# EAGLE design Ebot8_v_2 (EAGLE 7.7.0)
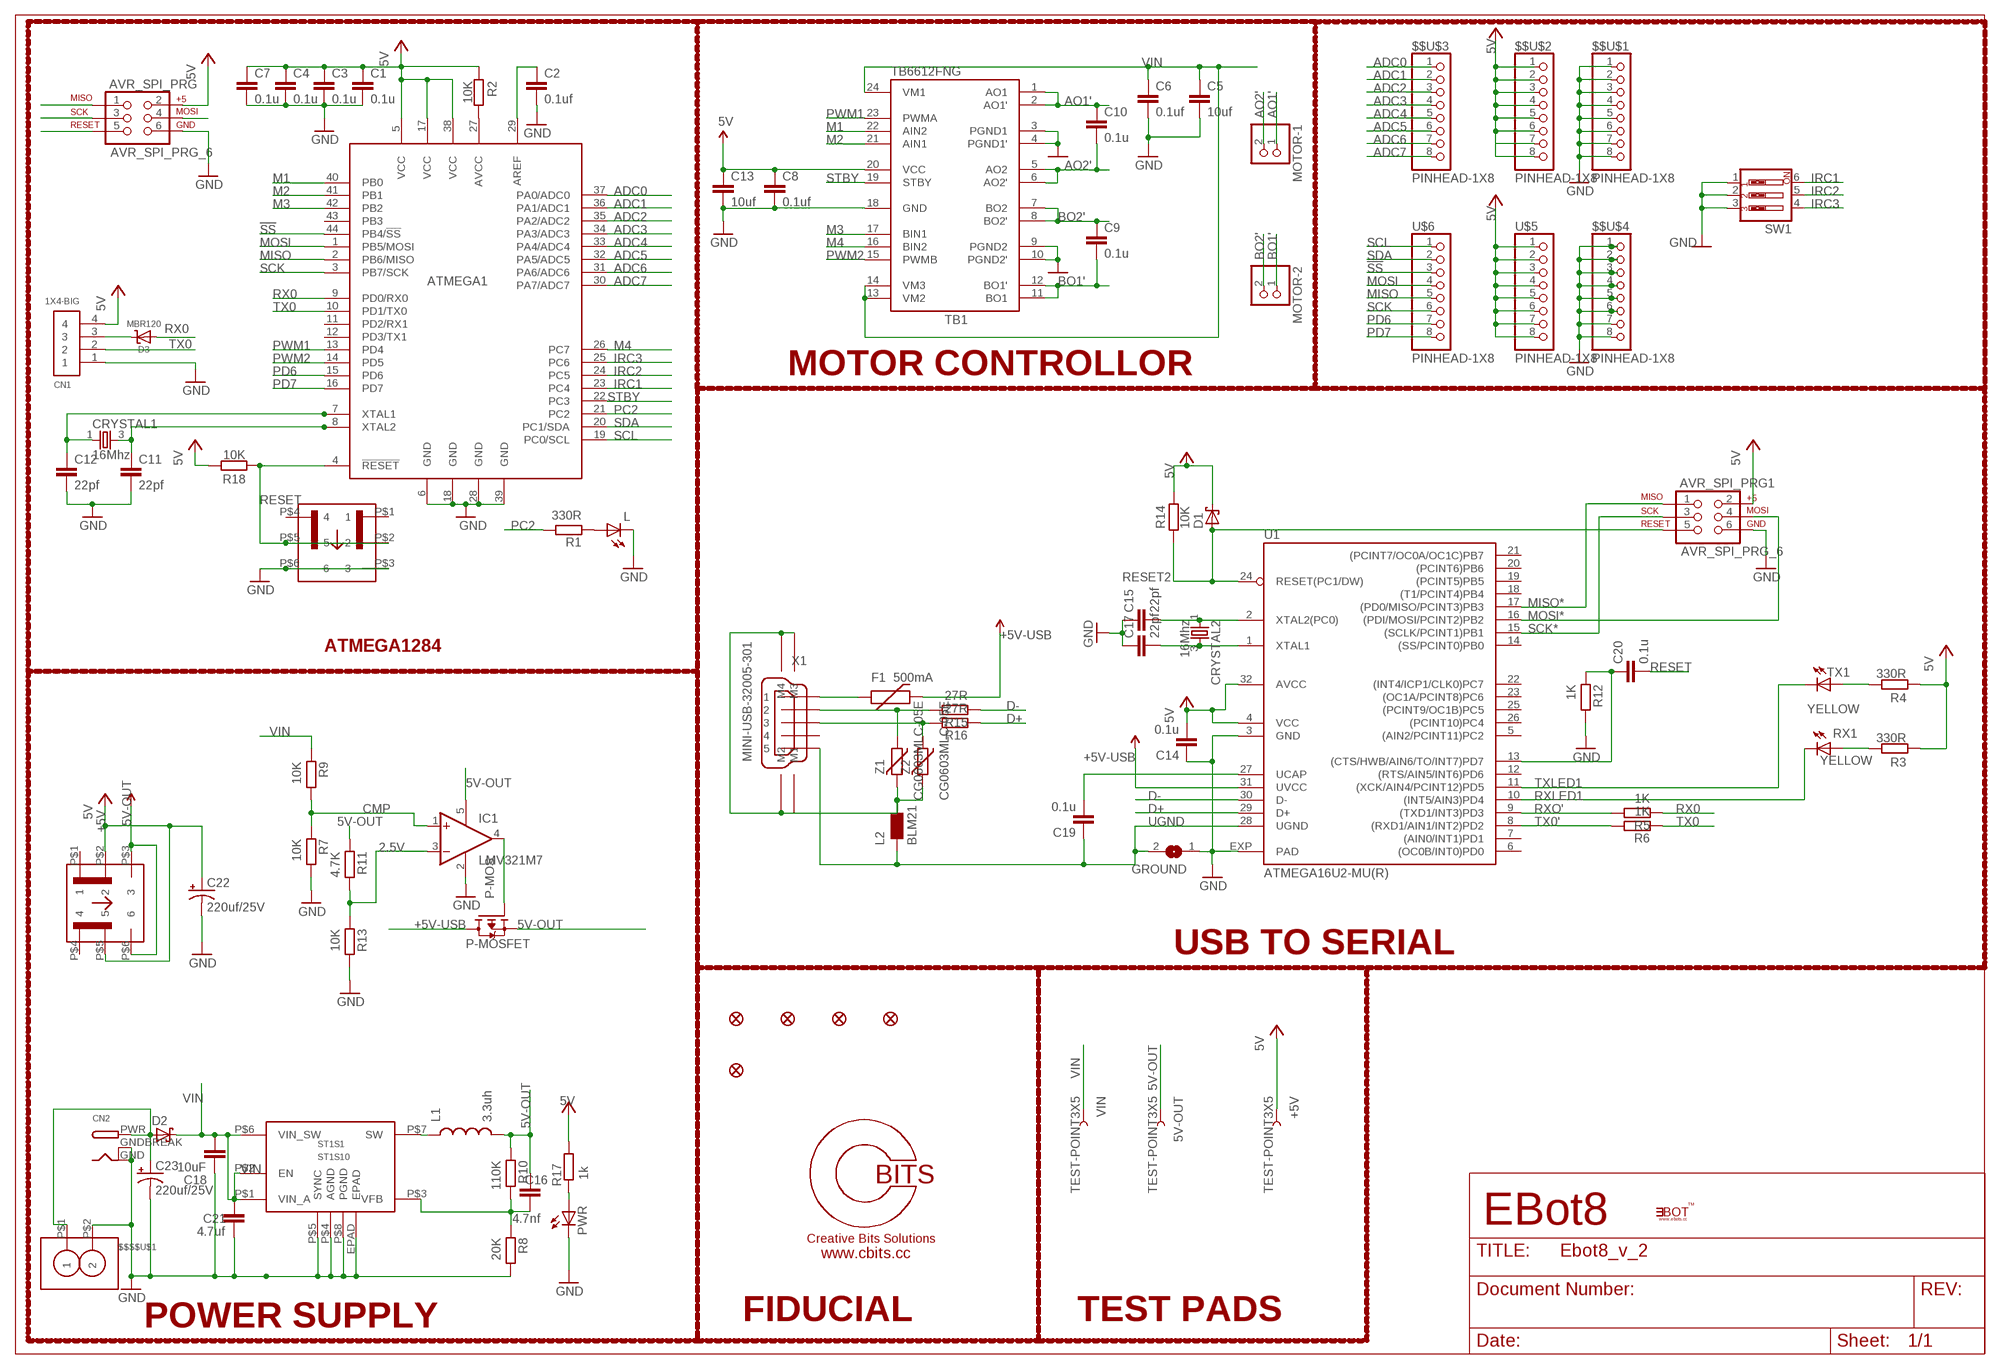
[diagram p0: schematic, sheet 1]

## Parts
5V-OUT  TEST-POINT3X5  [PAD.03X.05]
$$$$U$1  SCREW_CONNECTOR-2PIN-  [SCREW_CONNECTOR-2PIN-5.08MM]
$$U$1  PINHEAD-1X8  [PINHEAD-1X8]
$$U$2  PINHEAD-1X8  [PINHEAD-1X8]
$$U$3  PINHEAD-1X8  [PINHEAD-1X8]
$$U$4  PINHEAD-1X8  [PINHEAD-1X8]
+5V  TEST-POINT3X5  [PAD.03X.05]
ATMEGA1  ATMEGA164A/PA/324A/PA/644A/PA/1284/P  [44TQFP]
AVR_SPI_PRG  AVR_SPI_PRG_6  [2X3]
AVR_SPI_PRG1  AVR_SPI_PRG_6  [2X3]
C1  0.1u  CAPACITOR  [C0603]
C2  0.1uf  CAPACITOR  [C0603]
C3  0.1u  CAPACITOR  [C0603]
C4  0.1u  CAPACITOR  [C0603]
C5  10uf  CAPACITOR  [C0603]
C6  0.1uf  CAPACITOR  [C0603]
C7  0.1u  CAPACITOR  [C0603]
C8  0.1uf  CAPACITOR  [C0603]
C9  0.1u  CAPACITOR  [C0603]
C10  0.1u  CAPACITOR  [C0603]
C11  22pf  CAPACITOR  [C0603]
C12  22pf  CAPACITOR  [C0603]
C13  10uf  CAPACITOR  [C0603]
C14  0.1u  CAPACITOR  [C0603]
C15  22pf  CAPACITOR  [C0603]
C16  4.7nf  CAPACITOR  [C0603]
C17  22pf  CAPACITOR  [C0603]
C18  10uF  CAPACITOR  [C0603]
C19  0.1u  CAPACITOR  [C0603]
C20  0.1u  CAPACITOR  [C0603]
C21  4.7uf  CAPACITOR  [C0603]
C22  220uf/25V  CPOL-USE2.5-6  [E2,5-6]
C23  220uf/25V  CPOL-USE2.5-6  [E2,5-6]
CN1  1X4-BIG  [1X04-BIG]
CN2  DCBARRELPTH  [DCJACK_2MM_PTH]
CRYSTAL1  16Mhz  CRYSTAL4PIN  [CRYSTAL-4PIN]
CRYSTAL2  16Mhz  CRYSTAL4PIN  [CRYSTAL-4PIN]
D1  SCHOTTKY-DIODESMA2  [SCHOTTKY_SMA]
D2  SCHOTTKY-DIODESMA2  [SCHOTTKY_SMA]
D3  MBR120  DIODE-SCHOTTKYSOD-123  [SOD-123]
F1  500mA  PTCSMD  [PTC-1206]
FID1  FIDUCIAL1.5X3  [FIDUCIAL-1.5X3]
FID2  FIDUCIAL1.5X3  [FIDUCIAL-1.5X3]
FID3  FIDUCIAL1.5X3  [FIDUCIAL-1.5X3]
FID4  FIDUCIAL1.5X3  [FIDUCIAL-1.5X3]
FID100  FIDUCIAL1.5X3  [FIDUCIAL-1.5X3]
GROUND  SJ  [SJ]
IC1  LMV321M7  [SC70-5L]
L  LEDCHIP-LED0603  [CHIP-LED0603]
L1  3.3uh  INDUCTORCR54  [CR54]
L2  BLM21  WE-CBF_0805  [0805]
LOGO1  CBITS_LOGO  [CBITS_LOGO]
MOTOR-1  PINHD-1X2  [1X02]
MOTOR-2  PINHD-1X2  [1X02]
P-MOS  P-MOSFET  [SOT23-R]
POWER  PUSHBUTTON_SWITCH-CW179-ND  PUSHBUTTON_SWITCH-ON-OFF  [PUSHBUTTON_SWITCH]
PWR  LEDCHIP-LED0603  [CHIP-LED0603]
R1  330R  RESISTOR  [R0603]
R2  10K  RESISTOR  [R0603]
R3  330R  RESISTOR  [R0603]
R4  330R  RESISTOR  [R0603]
R5  1K  RESISTOR  [R0603]
R6  1K  RESISTOR  [R0603]
R7  10K  RESISTOR  [R0603]
R8  20K  RESISTOR  [R0603]
R9  10K  RESISTOR  [R0603]
R10  110K  RESISTOR  [R0603]
R11  4.7K  RESISTOR  [R0603]
R12  1K  RESISTOR  [R0603]
R13  10K  RESISTOR  [R0603]
R14  10K  RESISTOR  [R0603]
R15  27R  RESISTOR  [R0603]
R16  27R  RESISTOR  [R0603]
R17  1k  RESISTOR  [R0603]
R18  10K  RESISTOR  [R0603]
RESET  PUSHBUTTON_SWITCH-ON-MOM  [PUSHBUTTON_SWITCH]
RX1  YELLOW  LEDCHIP-LED0603  [CHIP-LED0603]
ST1S1  ST1S10  [ST1S10]
SW1  SW_DIP-3  [EDG-03]
TB1  TB6612FNG  [SSOP24]
TX1  YELLOW  LEDCHIP-LED0603  [CHIP-LED0603]
U1  ATMEGA16U2-MU(R)  SMARTPRJ_ATMEGA16U2-  [SMARTPRJ_ATMEL_QFN32]
U$5  PINHEAD-1X8  [PINHEAD-1X8]
U$6  PINHEAD-1X8  [PINHEAD-1X8]
U$14  EBOT_LOGO  [EBOT_LOGO]
VIN  TEST-POINT3X5  [PAD.03X.05]
X1  MINI-USB-32005-301  [32005-301]
Z1  CG0603MLC-05E  VARISTORCN0603  [CT/CN0603]
Z2  CG0603MLC-05E  VARISTORCN0603  [CT/CN0603]

## Nets
2.5V: IC1.3(-IN) R11.2 R13.1
5V-OUT: 5V-OUT.P$1 C16.1 IC1.5(V+) L1.P$2 P-MOS.2(S) POWER.P$3 POWER.P$6 R10.1 R11.1 ; supply symbol labelled 5V
!SS: ATMEGA1.44(PB4/!SS) U$6.3
+5V: $$U$2.1 $$U$2.2 $$U$2.3 $$U$2.4 $$U$2.5 $$U$2.6 $$U$2.7 $$U$2.8 +5V.P$1 ATMEGA1.5(VCC) ATMEGA1.17(VCC) ATMEGA1.38(VCC) AVR_SPI_PRG1.2 AVR_SPI_PRG.2 C1.1 C3.1 C4.1 C7.1 C8.1 C13.1 C14.2 C22.+ CN1.4 D1.C POWER.P$2 POWER.P$5 R2.1 R3.1 R4.1 R14.2 R17.2 R18.2 TB1.20(VCC) U1.4(VCC) U1.32(AVCC) U$5.1 U$5.2 U$5.3 U$5.4 U$5.5 U$5.6 U$5.7 U$5.8 ; supply symbol labelled 5V
+5V-USB: F1.2 P-MOS.3(D) U1.31(UVCC) ; supply symbol labelled 5V
ADC0: $$U$3.1 ATMEGA1.37(PA0/ADC0)
ADC1: $$U$3.2 ATMEGA1.36(PA1/ADC1)
ADC2: $$U$3.3 ATMEGA1.35(PA2/ADC2)
ADC3: $$U$3.4 ATMEGA1.34(PA3/ADC3)
ADC4: $$U$3.5 ATMEGA1.33(PA4/ADC4)
ADC5: $$U$3.6 ATMEGA1.32(PA5/ADC5)
ADC6: $$U$3.7 ATMEGA1.31(PA6/ADC6)
ADC7: $$U$3.8 ATMEGA1.30(PA7/ADC7)
AO1': C10.1 MOTOR-1.1 TB1.1(AO1) TB1.2(AO1')
AO2': C10.2 MOTOR-1.2 TB1.5(AO2) TB1.6(AO2')
AREF: ATMEGA1.29(AREF) C2.1
BO1': C9.2 MOTOR-2.1 TB1.11(BO1) TB1.12(BO1')
BO2': C9.1 MOTOR-2.2 TB1.7(BO2) TB1.8(BO2')
CMP: IC1.1(+IN) R7.1 R9.2
D+: R16.1 U1.29(D+)
D-: R15.1 U1.30(D-)
GATE_CMD: IC1.4(OUT) P-MOS.1(G)
GND: $$$$U$1.P$2 $$U$1.1 $$U$1.2 $$U$1.3 $$U$1.4 $$U$1.5 $$U$1.6 $$U$1.7 $$U$1.8 $$U$4.1 $$U$4.2 $$U$4.3 $$U$4.4 $$U$4.5 $$U$4.6 $$U$4.7 $$U$4.8 ATMEGA1.6(GND) ATMEGA1.18(GND) ATMEGA1.28(GND) ATMEGA1.39(GND) AVR_SPI_PRG1.6 AVR_SPI_PRG.6 C1.2 C2.2 C3.2 C4.2 C5.2 C6.2 C7.2 C8.2 C11.2 C12.2 C13.2 C14.1 C15.1 C17.1 C18.2 C21.2 C22.- C23.- CN1.1 CN2.GND CN2.GNDBREAK GROUND.1 IC1.2(V-) L.C PWR.C R7.2 R8.2 R12.2 R13.2 RESET.P$3 RESET.P$6 ST1S1.EPAD ST1S1.P$4(AGND) ST1S1.P$5(SYNC) ST1S1.P$8(PGND) SW1.1 SW1.2 SW1.3 TB1.3(PGND1) TB1.4(PGND1') TB1.9(PGND2) TB1.10(PGND2') TB1.18(GND) U1.3(GND) U1.EXP(PAD)
IRC1: ATMEGA1.23(PC4) SW1.6
IRC2: ATMEGA1.24(PC5) SW1.5
IRC3: ATMEGA1.25(PC6) SW1.4
M1: ATMEGA1.40(PB0) TB1.22(AIN2)
M2: ATMEGA1.41(PB1) TB1.21(AIN1)
M3: ATMEGA1.42(PB2) TB1.17(BIN1)
M4: ATMEGA1.26(PC7) TB1.16(BIN2)
MISO: ATMEGA1.2(PB6/MISO) AVR_SPI_PRG.1 U$6.5
MISO*: AVR_SPI_PRG1.1 U1.17((PD0/MISO/PCINT3)PB3)
MOSI: ATMEGA1.1(PB5/MOSI) AVR_SPI_PRG.4 U$6.4
MOSI*: AVR_SPI_PRG1.4 U1.16((PDI/MOSI/PCINT2)PB2)
N$1: PWR.A R17.1
N$2: $$$$U$1.P$1 C23.+ CN2.PWR D2.A
N$3: R3.2 RX1.A
N$4: R4.2 TX1.A
N$5: C15.2 CRYSTAL2.1 U1.2(XTAL2(PC0))
N$6: ATMEGA1.27(AVCC) R2.2
N$7: C17.2 CRYSTAL2.3 U1.1(XTAL1)
N$8: C19.2 U1.27(UCAP)
N$9: C20.1 R12.1 U1.13((CTS/HWB/AIN6/TO/INT7)PD7)
N$10: L2.2 X1.M1 X1.M2 X1.M3 X1.M4 Z1.2 Z2.2
N$11: CN1.3 D3.C
N$17: L.A R1.1
N$20: F1.1 X1.1
N$21: R15.2 X1.2 Z1.1
N$23: R16.2 X1.3 Z2.1
N$37: L1.P$1 ST1S1.P$7(SW)
N$38: C16.2 R8.1 R10.2 ST1S1.P$3(VFB)
N$40: ATMEGA1.8(XTAL2) C11.1 CRYSTAL1.3
N$41: ATMEGA1.7(XTAL1) C12.1 CRYSTAL1.1
PC2: ATMEGA1.21(PC2) R1.2
PD6: ATMEGA1.15(PD6) U$6.7
PD7: ATMEGA1.16(PD7) U$6.8
PWM1: ATMEGA1.13(PD4) TB1.23(PWMA)
PWM2: ATMEGA1.14(PD5) TB1.15(PWMB)
RESET: ATMEGA1.4(!RESET) AVR_SPI_PRG.5 C20.2 R18.1 RESET.P$2 RESET.P$5
RESET2: AVR_SPI_PRG1.5 D1.A R14.1 U1.24(RESET(PC1/DW))
RX0: ATMEGA1.9(PD0/RX0) D3.A R5.1
RXLED1: RX1.C U1.10((INT5/AIN3)PD4)
RXO': R5.2 U1.9((TXD1/INT3)PD3)
SCK: ATMEGA1.3(PB7/SCK) AVR_SPI_PRG.3 U$6.6
SCK*: AVR_SPI_PRG1.3 U1.15((SCLK/PCINT1)PB1)
SCL: ATMEGA1.19(PC0/SCL) U$6.1
SDA: ATMEGA1.20(PC1/SDA) U$6.2
STBY: ATMEGA1.22(PC3) TB1.19(STBY)
TX0: ATMEGA1.10(PD1/TX0) CN1.2 R6.1
TX0': R6.2 U1.8((RXD1/AIN1/INT2)PD2)
TXLED1: TX1.C U1.11((XCK/AIN4/PCINT12)PD5)
UGND: C19.1 GROUND.2 L2.1 U1.28(UGND) X1.5
VIN: C5.1 C6.1 C18.1 C21.1 D2.C R9.1 ST1S1.P$1(VIN_A) ST1S1.P$2(EN) ST1S1.P$6(VIN_SW) TB1.13(VM2) TB1.14(VM3) TB1.24(VM1) VIN.P$1
Unconnected: ATMEGA1.11(PD2/RX1) ATMEGA1.12(PD3/TX1) ATMEGA1.43(PB3) POWER.P$1 POWER.P$4 RESET.P$1 RESET.P$4 U1.5((AIN2/PCINT11)PC2) U1.6((OC0B/INT0)PD0) U1.7((AIN0/INT1)PD1) U1.12((RTS/AIN5/INT6)PD6) U1.14((SS/PCINT0)PB0) U1.18((T1/PCINT4)PB4) U1.19((PCINT5)PB5) U1.20((PCINT6)PB6) U1.21((PCINT7/OC0A/OC1C)PB7) U1.22((INT4/ICP1/CLK0)PC7) U1.23((OC1A/PCINT8)PC6) U1.25((PCINT9/OC1B)PC5) U1.26((PCINT10)PC4) X1.4

## Notes on the sheet
- MOTOR CONTROLLOR
- ATMEGA1284
- USB TO SERIAL
- EBot8
- POWER SUPPLY | FIDUCIAL | TEST PADS

## Power pins joined to a net without a drawn wire
GND: ST1S1.P$9(GND) ST1S1.P$10(GND) ST1S1.P$11(GND) ST1S1.P$12(GND) ST1S1.P$13(GND) ST1S1.P$14(GND) ST1S1.P$15(GND) ST1S1.P$16(GND) ST1S1.P$17(GND)

## Library data of the parts
5V-OUT +5V VIN = SparkFun-Passives:TEST-POINT: Bare copper test points for troubleshooting or ICT
$$$$U$1 = BaseApp:SCREW_CONNECTOR-2PIN
$$U$1-$$U$4 U$5 U$6 = BaseApp:PINHEAD-1X8
ATMEGA1 = BaseApp:ATMEGA164A/PA/324A/PA/644A/PA/1284/P
AVR_SPI_PRG AVR_SPI_PRG1 = BaseApp:AVR_SPI_PRG_6
C1-C21 = BaseApp:CAPACITOR
C22 C23 = adafruit:CPOL-US: POLARIZED CAPACITOR, American symbol
CN1 = adafruit:1X4: 4-pin connector
CN2 = adafruit:DCBARREL: 2.0mm DC Barrel Jack DCJACK_2MM_PTH - Through Hole Jack (4UConnector: 05537)
CRYSTAL1 CRYSTAL2 = BaseApp:CRYSTAL: CRYSTAL SMD-10.5X4.8-2PIN :- http://www.digikey.com/product-detail/en/CX49GFNB12000H0PESZZ/478-4349-1-ND/1532102 SMD-5X3- 4PIN :- 535-11281-1-ND
D1 D2 = BaseApp:SCHOTTKY-DIODE
D3 = microbuilder:DIODE-SCHOTTKY
F1 = SparkFun:PTC: Resettable Fuse PTC Resettable Fuse. Spark Fun Electronics SKU : COM-08357
FID1-FID4 FID100 = SparkFun-Aesthetics:FIDUCIAL: Fiducial Alignment Points Various fiducial points for machine vision alignment.
GROUND = jumper:SJ: SMD solder JUMPER
IC1 = linear:LMV321?*: General Purpose, Low Voltage, Rail-to-Rail Output Operational Amplifiers Source: http://www.national.com/mpf/LM/LMV321.html http://www.national.com/dt/lmv_qual.pdf
L PWR RX1 TX1 = adafruit:LED: LED OSRAM: - CHIPLED LG R971, LG N971, LY N971, LG Q971, LY Q971, LO R971, LY R971 LH N974, LH R974 LS Q976, LO Q976, LY Q976 LO Q996 - Hyper CHIPLED LW Q18S LB Q993, LB Q99A, LB R99A - SideLED LS A670, LO A670, LY A670, LG A670, LP A670 LB A673, LV A673, LT A673, LW A673 LH A674 LY A675 LS A676, LA A676, LO A676, LY A676, LW A676 LS A679, LY A679, LG A679 - Hyper Micro SIDELED® LS Y876, LA Y876, LO Y876, LY Y876 LT Y87S - SmartLED LW L88C, LW L88S LB L89C, LB L89S, LG L890 LS L89K, LO L89K, LY L89K LS L896, LA L896, LO L896, LY L896 - TOPLED LS T670, LO T670, LY T670, LG T670, LP T670 LSG T670, LSP T670, LSY T670, LOP T670, LYG T670 LG T671, LOG T671, LSG T671 LB T673, LV T673, LT T673, LW T673 LH T674 LS T676, LA T676, LO T676, LY T676, LB T676, LH T676, LSB T676, LW T676 LB T67C, LV T67C, LT T67C, LS T67K, LO T67K, LY T67K, LW E67C LS E67B, LA E67B, LO E67B, LY E67B, LB E67C, LV E67C, LT E67C LW T67C LS T679, LY T679, LG T679 LS T770, LO T770, LY T770, LG T770, LP T770 LB T773, LV T773, LT T773, LW T773 LH T774 LS E675, LA E675, LY E675, LS T675 LS T776, LA T776, LO T776, LY T776, LB T776 LHGB T686 LT T68C, LB T68C - Hyper Mini TOPLED® LB M676 - Mini TOPLED Santana® LG M470 LS M47K, LO M47K, LY M47K Source: http://www.osram.convergy.de/
L1 = SparkFun-Passives:INDUCTOR: Inductors Basic Inductor/Choke - 0603 and 1206. Footprints are not proven and vary greatly between part numbers.
L2 = wuerth-elektronik:WE-CBF: SMD EMI Suppression Ferrite Beads - excellent anti-EMI properties - low DCR - impedances till 3000 ohms - rated current up to 6 A
LOGO1 = cbitslogo:CBITS_LOGO
MOTOR-1 MOTOR-2 = pinhead:PINHD-1X2: PIN HEADER
P-MOS = BaseApp:P-MOSFET
POWER RESET = BaseApp:PUSHBUTTON_SWITCH: On-Off type's Digikey No. : CW179-ND. On-Mom type's Digikey No. : CW180-ND.
R1-R18 = BaseApp:RESISTOR: Resistance Package :- 0603 Mount :-Surface mount
ST1S1 = BaseApp:ST1S10
SW1 = special:SW_DIP-3: DIP SWITCH
TB1 = adafruit:TB6612FNG: TB6612FNG MOS dual H-bridge motor driver, 1.2A current 3.2A peak 3 or 5v logic and 3-15v motor
U1 = arduino_Uno_Rev3-02-TH:SMARTPRJ_ATMEGA16U2-
U$14 = creativeBits:EBOT_LOGO
X1 = con-cypressindustries:MINI-USB-: MINI USB-B Conector Source: www.cypressindustries.com; OC_FARNELL: unknown; OC_NEWARK: unknown
Z1 Z2 = varistor:VARISTOR: VARISTOR

## Net classes
0 default: width 0.152 mm, drill 0.305 mm, clearance 0.152 mm

## Board
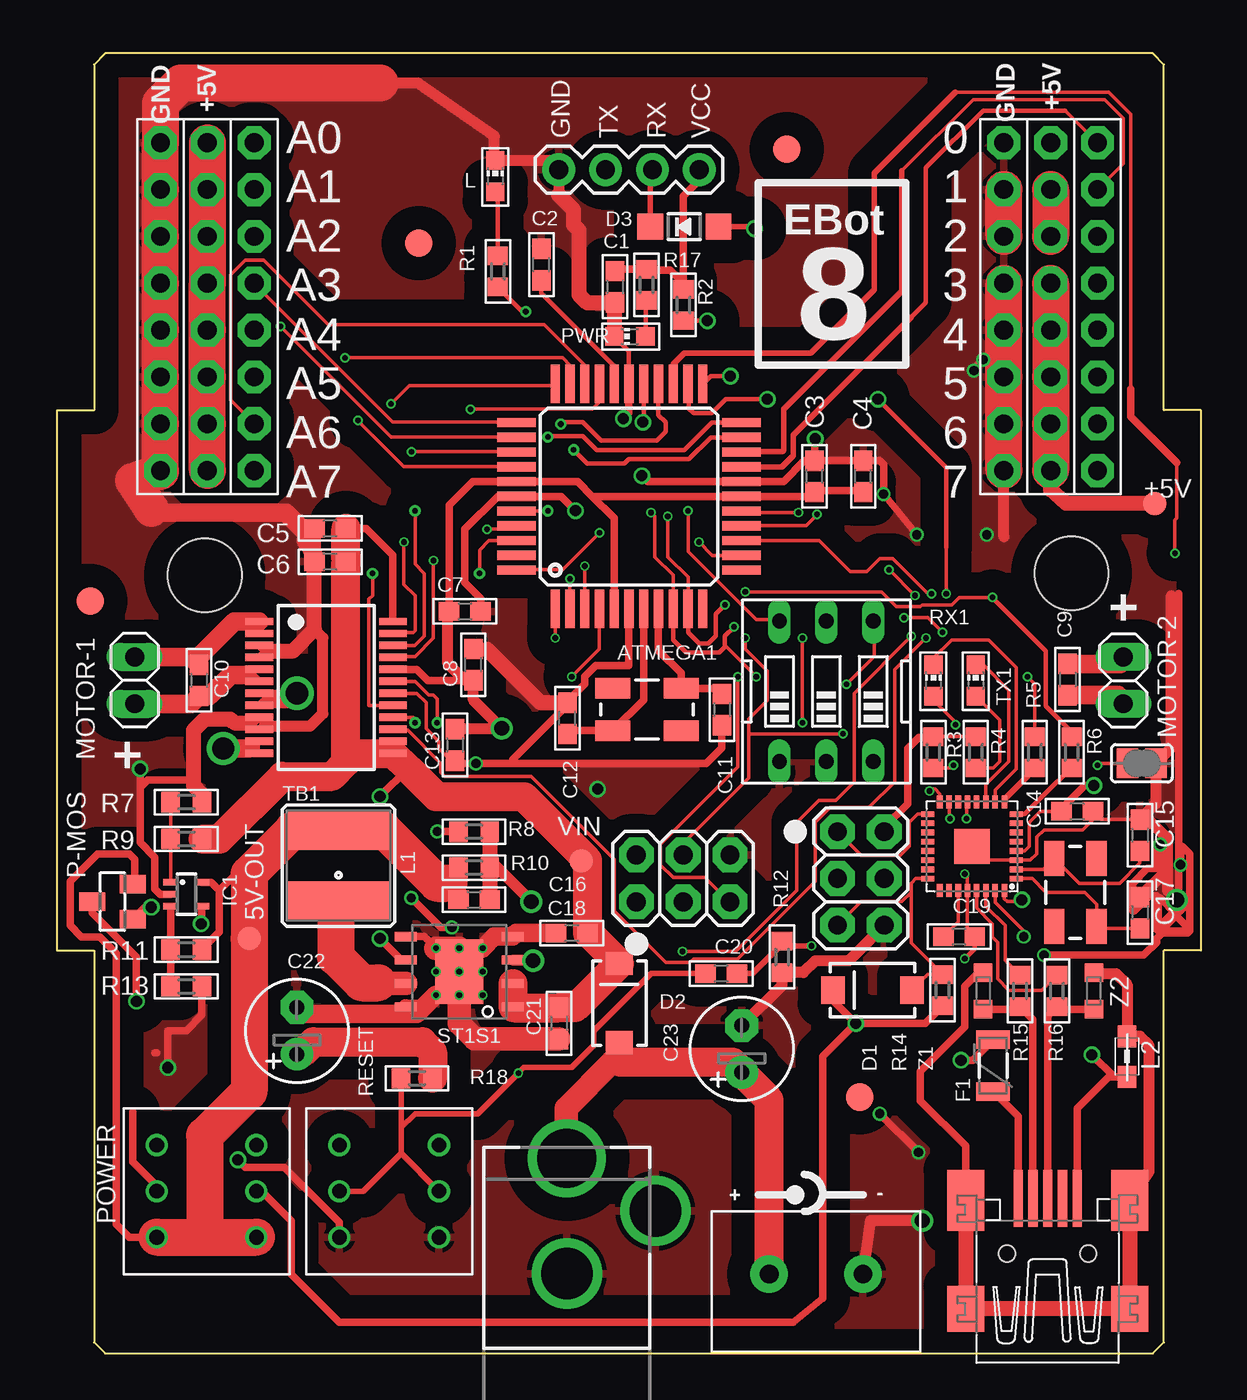
[diagram p1: board, top side]
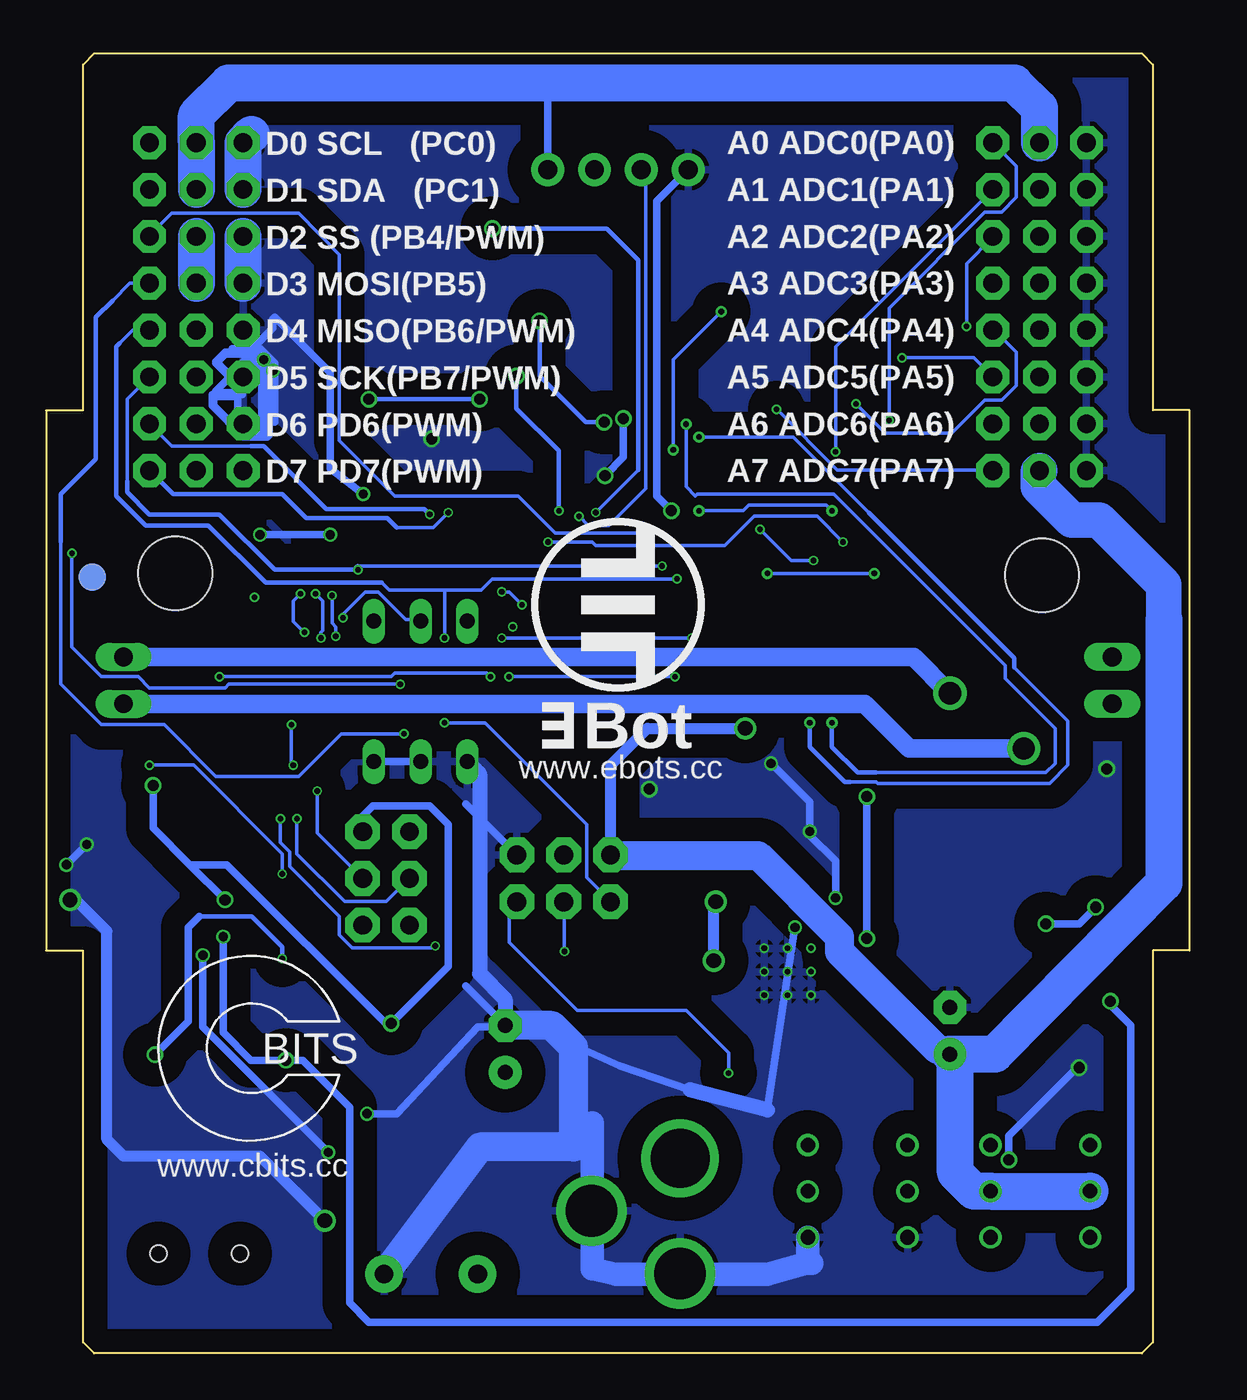
[diagram p2: board, bottom side, seen from below]

Size 62 x 70.5 mm. Coordinates in mm from the lower left corner, seen from the top.
Outline: 2.6,0 59.4,0 60,0.6 60,21.85 62,21.85 62,51.15 60,51.15 60,69.9 59.4,70.5 2.6,70.5 2,69.9 2,51.15 0,51.15 0,21.85 2,21.85 2,0.6 2.6,0
Copper layers (1*16): Top 0.035559375mm / dielectric 0.17018125mm / Bottom 0.035559375mm
Design rules "OSHPark-4layer *": minimum track width 5mil, minimum drill 10mil, track to track 5mil, track to pad 5mil, pad to pad 5mil, via to via 5mil, smd to smd 5mil, copper to edge 15mil, drill to drill 6mil, minimum pad ring 4mil, minimum via ring 4mil, stop-mask expansion 2.5mil, vias tented up to drill 0mil, thermal gap 10mil
Holes 4 mm at 55,42.3 8,42.2

### Footprints (pad centres in the part's own frame; a part is rotated, then mirrored left to right if it is on the bottom)
PAD.03X.05 = smd 1.27 x 1.27: P$1 0,0
SCREW_CONNECTOR-2PIN-5.08MM = drill 1.016 pad 2.032: P$1 0,0; P$2 5.08,0
PINHEAD-1X8 = drill 1.016 pad 1.778 octagon: 1 -8.89,0; 2 -6.35,0; 3 -3.81,0; 4 -1.27,0; 5 1.27,0; 6 3.81,0; 7 6.35,0; 8 8.89,0
44TQFP = smd 2.1 x 0.5: 1 -6.1,4; 2 -6.1,3.2; 3 -6.1,2.4; 4 -6.1,1.6; 5 -6.1,0.8; 6 -6.1,0; 7 -6.1,-0.8; 8 -6.1,-1.6; 9 -6.1,-2.4; 10 -6.1,-3.2; 11 -6.1,-4; 23 6.1,-4; 24 6.1,-3.2; 25 6.1,-2.4; 26 6.1,-1.6; 27 6.1,-0.8; 28 6.1,0; 29 6.1,0.8; 30 6.1,1.6; 31 6.1,2.4; 32 6.1,3.2; 33 6.1,4 | smd 0.5 x 2.1: 12 -4,-6.1; 13 -3.2,-6.1; 14 -2.4,-6.1; 15 -1.6,-6.1; 16 -0.8,-6.1; 17 0,-6.1; 18 0.8,-6.1; 19 1.6,-6.1; 20 2.4,-6.1; 21 3.2,-6.1; 22 4,-6.1; 34 4,6.1; 35 3.2,6.1; 36 2.4,6.1; 37 1.6,6.1; 38 0.8,6.1; 39 0,6.1; 40 -0.8,6.1; 41 -1.6,6.1; 42 -2.4,6.1; 43 -3.2,6.1; 44 -4,6.1
2X3 = drill 1.016 pad 1.88 octagon: 1 0,0; 2 0,2.54; 3 2.54,0; 4 2.54,2.54; 5 5.08,0; 6 5.08,2.54
C0603 = smd 1.1 x 1: 1 -0.85,0; 2 0.85,0
E2,5-6 = drill 0.813 pad 1.778: + -1.27,0 | drill 0.813 pad 1.778 octagon: - 1.27,0
1X04-BIG = drill 1.016 pad 1.778: 1 0,0; 2 2.54,0; 3 5.08,0; 4 7.62,0
DCJACK_2MM_PTH = drill 2.8: GND 0,7.35; GNDBREAK 4.8,10.75 | drill 3.2: PWR 0,13.6
CRYSTAL-4PIN = smd 1.9 x 1.1: 1 -1.85,-1.15; 2 1.85,-1.15; 3 1.85,1.15; 4 -1.85,1.15
SCHOTTKY_SMA = smd 1.27 x 1.47: A -2.15,0; C 2.15,0
SOD-123 = smd 1.4 x 1.4: A 1.85,0; C -1.85,0
PTC-1206 = smd 1 x 1.8: 1 -1.4,0; 2 1.4,0
FIDUCIAL-1.5X3 = smd 1.5 x 1.5: 1 0,0
SJ = smd 1.168 x 1.6: 1 -0.762,0; 2 0.762,0
SC70-5L = smd 0.35 x 0.8: 1 -0.65,-0.85; 2 0,-0.85; 3 0.65,-0.85; 4 0.65,0.85; 5 -0.65,0.85
CHIP-LED0603 = smd 1 x 1: A 0,-0.85; C 0,0.85
CR54 = smd 5.5 x 2.15: P$1 0,1.92; P$2 0,-1.92
0805 = smd 1.2 x 1: 1 -1.1,0; 2 1.1,0
1X02 = drill 1.016 long: 1 -1.27,0; 2 1.27,0
SOT23-R = smd 1 x 1.4: 1 -0.95,-1.1; 2 0.95,-1.1; 3 0,1.1
PUSHBUTTON_SWITCH = drill 0.8: P$1 -2.5,2.7; P$2 0,2.7; P$3 2.5,2.7; P$4 -2.5,-2.7; P$5 0,-2.7; P$6 2.5,-2.7
R0603 = smd 1 x 1.1: 1 -0.85,0; 2 0.85,0
ST1S10 = smd 3.5 x 2.6: EPAD 0,0 | smd 0.5 x 1.2: P$1 -1.905,-2.904; P$2 -0.635,-2.904; P$3 0.635,-2.904; P$4 1.905,-2.904; P$5 1.905,2.904; P$6 0.635,2.904; P$7 -0.635,2.904; P$8 -1.905,2.904 | drill 0.305: P$9 0,0; P$10 0,1.27; P$11 0,-1.27; P$12 1.27,0; P$13 1.27,1.27; P$14 1.27,-1.27; P$15 -1.27,-1.27; P$16 -1.27,0; P$17 -1.27,1.27
EDG-03 = drill 0.813 long: 1 -2.54,-3.81; 2 0,-3.81; 3 2.54,-3.81; 4 2.54,3.81; 5 0,3.81; 6 -2.54,3.81
SSOP24 = smd 0.4 x 1.5: 1 -3.575,-3.625; 2 -2.925,-3.625; 3 -2.275,-3.625; 4 -1.625,-3.625; 5 -0.975,-3.625; 6 -0.325,-3.625; 7 0.325,-3.625; 8 0.975,-3.625; 9 1.625,-3.625; 10 2.275,-3.625; 11 2.925,-3.625; 12 3.575,-3.625; 13 3.575,3.625; 14 2.925,3.625; 15 2.275,3.625; 16 1.625,3.625; 17 0.975,3.625; 18 0.325,3.625; 19 -0.325,3.625; 20 -0.975,3.625; 21 -1.625,3.625; 22 -2.275,3.625; 23 -2.925,3.625; 24 -3.575,3.625
SMARTPRJ_ATMEL_QFN32 = smd 0.711 x 0.305: 1 -2.4,1.75; 2 -2.4,1.25; 3 -2.4,0.75; 4 -2.4,0.25; 5 -2.4,-0.25; 6 -2.4,-0.75; 7 -2.4,-1.25; 8 -2.4,-1.75; 17 2.4,-1.75; 18 2.4,-1.25; 19 2.4,-0.75; 20 2.4,-0.25; 21 2.4,0.25; 22 2.4,0.75; 23 2.4,1.25; 24 2.4,1.75 | smd 0.305 x 0.711: 9 -1.75,-2.4; 10 -1.25,-2.4; 11 -0.75,-2.4; 12 -0.25,-2.4; 13 0.25,-2.4; 14 0.75,-2.4; 15 1.25,-2.4; 16 1.75,-2.4; 25 1.75,2.4; 26 1.25,2.4; 27 0.75,2.4; 28 0.25,2.4; 29 -0.25,2.4; 30 -0.75,2.4; 31 -1.25,2.4; 32 -1.75,2.4 | smd 1.905 x 1.905: EXP 0,0
32005-301 = smd 3.1 x 0.5: 1 3,1.6; 2 3,0.8; 3 3,0; 4 3,-0.8; 5 3,-1.6 | smd 2.5 x 2: M1 -3,-4.45; M2 -3,4.45 | smd 3.3 x 2: M3 2.9,4.45; M4 2.9,-4.45 | hole 0.9: 0,2.2; 0,-2.2
CT/CN0603 = smd 1 x 1: 1 -1,0; 2 1,0

### Placement (x,y rotation side)
5V-OUT  10.4,22.5 0 top
$$$$U$1  38.6,4.3 0 top
$$U$1  5.6,56.77 270 top
$$U$2  8.14,56.77 270 top
$$U$3  10.68,56.77 270 top
$$U$4  51.32,56.77 270 top
+5V  59.5,46.1 0 top
ATMEGA1  31,46.48 90 top
AVR_SPI_PRG  31.4,24.49 0 top
AVR_SPI_PRG1  42.3,28.3 270 top
C1  30.24,57.85 270 top
C2  26.25,59.05 90 top
C3  41.06,47.56 90 top
C4  43.7,47.56 90 top
C5  14.8,44.74 180 top
C6  14.8,42.94 180 top
C7  22.1,40.24 0 top
C8  22.56,37.35 90 top
C9  54.78,36.55 270 top
C10  7.68,36.5 270 top
C11  36.04,34.91 270 top
C12  27.66,34.44 90 top
C13  21.56,33 270 top
C14  55.3,29.4 180 top
C15  58.7,28.1 270 top
C16  22.6,24.6 0 top
C17  58.7,23.9 270 top
C18  27.9,22.8 180 top
C19  48.9,22.6 180 top
C20  36,20.6 180 top
C21  27.2,17.9 270 top
C22  13,17.5 90 top
C23  37.11,16.51 90 top
CN1  27.19,64.2 0 top
CN2  27.63,-3.02 0 top
CRYSTAL1  31.98,34.92 0 top
CRYSTAL2  55.2,25 270 top
D1  44.2,19.7 180 top
D2  30.48,19 90 top
D3  34,61.1 0 top
F1  50.74,15.61 90 top
FID1  19.6,60.2 0 top
FID2  39.55,65.3 0 top
FID3  1.8,40.8 0 top
FID4  43.5,13.9 0 top
FID100  59.5,42.1 0 bottom
GROUND  58.8,32 180 top
IC1  7,24.9 270 top
L  23.75,63.85 0 top
L1  15.25,26.45 180 top
L2  58,16.1 90 top
LOGO1  50.9,16.5 0 bottom
MOTOR-1  4.2,36.5 270 top
MOTOR-2  57.8,36.5 90 top
P-MOS  3,24.5 90 top
POWER  8.1,8.8 270 top
PWR  31.05,55.15 90 top
R1  23.89,58.68 270 top
R2  33.95,56.86 270 top
R3  47.5,32.6 270 top
R4  49.8,32.6 270 top
R5  53,32.6 270 top
R6  55,32.6 270 top
R7  7,29.9 0 top
R8  22.6,28.3 180 top
R9  7,27.9 180 top
R10  22.6,26.35 0 top
R11  7,21.9 180 top
R12  39.3,21.5 270 top
R13  7,19.9 0 top
R14  48,19.7 270 top
R15  52.2,19.66 270 top
R16  54.2,19.66 270 top
R17  31.95,57.95 90 top
R18  19.5,14.92 0 top
RESET  18,8.8 270 top
RX1  47.5,36.5 0 top
ST1S1  21.8,20.7 90 top
SW1  41.7,35.9 0 top
TB1  14.58,36.12 270 top
TX1  49.8,36.5 0 top
U1  49.6,27.5 180 top
U$5  53.86,56.77 270 top
U$6  56.4,56.77 270 top
U$14  31,35.6 0 bottom
VIN  28.4,26.7 0 top
X1  53.7,5.41 90 top
Z1  50.2,19.66 90 top
Z2  56.2,19.66 90 top

### Tracks (layer width: path | path; a pad name or v marks a point on that pad's centre or on a via)
2.5V
  Top 0.406: IC1.3 R11.2 R13.1
5V-OUT
  Top 0.406: IC1.5 8.35,25.55 8.8,25.1 | 8.8,25.1 8.8,22.85 R11.1 | 8.8,25.1 9.7,26 10.4,26 | P-MOS.2 4.2,25.55 4.2,26.8 3.9,27.1 2.2,27.1 0.7,25.6 0.7,23.2 1.3,22.6 2.3,22.6 3.2,21.7 3.2,7 3.9,6.3 POWER.P$6
  Top 0.813: R10.1 21.75,25.7 | 21.75,25.5 C16.1
  Top 1.016: 21.75,25.7 21.75,25.5 21.1,25.5
  Top 2: 21.1,25.5 20.6,25.5 17.73,28.37 L1.P$2 12.77,28.37 10.4,26 5V-OUT.P$1 10.4,14.2 8,11.8 8,6.9 8.6,6.3 | 8.6,6.3 POWER.P$3 | POWER.P$6 8.6,6.3
!SS  (via drill 0.3)
  Top 0.2: v29.4,44.5 27.4,42.5 24.9,42.5 ATMEGA1.44
  Bottom 0.2: v29.4,44.5 34.4,44.5 36.4,46.5 43.1,46.5 46.1,49.5 46.1,59.6 48.3,61.85 55.18,61.85 U$6.3
+5V  (via drill 0.6, 0.8)
  Top 0.2: U1.4 52.45,27.25 52.7,27.5 52.7,28.8 53.3,29.4 C14.2 54.45,29.55 | R3.1 R4.1 | U1.32 51.35,24.65 51.5,24.5 52.2,24.5 v52.3,24.6
  Top 0.254: C1.1 30.34,58.8 | R17.2 32,58.75 | 33.95,58.05 R2.1
  Top 0.406: 37.1,46.5 ATMEGA1.17 | TB1.20 19.5,37.09 20.09,36.5 C8.1 | 4.1,13.1 4.1,10.4 5.4,9.1 POWER.P$5 | ATMEGA1.38 23.98,47.28 | C7.1 21.25,46 22.53,47.28 ATMEGA1.38 | ATMEGA1.5 30.2,45.3 29.02,46.48 | ATMEGA1.38 28.22,47.28 29.02,46.48 | ATMEGA1.17 29.02,46.48 | ATMEGA1.17 40.83,46.48 C3.1 41.2,46.8 43.7,46.8 C4.1 | CN1.4 34.81,63.62 33.95,62.76 R2.1 | v43.3,17.9 42.05,19.15 D1.C | R3.1 47.45,33.45 47.4,33.4 46.7,33.4 46.1,32.8 46.1,29.8 44.84,28.54 AVR_SPI_PRG1.2 | R14.2 47.05,17.9 v43.3,17.9 | v43.3,17.9 41.5,16.1 41.5,3 39.9,1.7 15.3,1.7 12.7,4.3 12.7,7.2 11.1,8.8 POWER.P$2 | 54.45,29.55 55.7,30.8 v56.2,30.8 | 30.34,58.8 R17.2 | 32,58.75 33.25,58.75 33.95,58.05
  Top 0.61: C13.1 21.71,33.9 v24.1,33.9 22.56,35.44 C8.1 22.1,36.5 21.15,37.45 21.15,40.14 C7.1
  Top 0.813: +5V.P$1 54.7,46.1 53.86,46.84 U$5.8
  Top 1.56: C22.+ 13,16.3 13.3,16.3 13.9,16.9 19.8,16.9 20.35,16.35 R18.2
  Top 2: $$U$2.8 $$U$2.7 $$U$2.6 $$U$2.5 $$U$2.4 $$U$2.3 $$U$2.2 $$U$2.1 | U$5.2 U$5.3 | U$5.4 U$5.5 U$5.6 U$5.7 U$5.8
  Bottom 0.406: 29,27 29.3,27 | 35.1,68.9 34.8,68.6 34.8,64.7 34.81,64.69 CN1.4 | v52.3,24.6 54.2,26.5 | 54.2,26.5 56.2,28.5 v56.2,30.8 | AVR_SPI_PRG1.2 44.84,29.16 44.3,29.7 41.2,29.7 40.2,28.7 40.2,21 v43.3,17.9 43.6,17.9 52.2,26.5 54.2,26.5
  Bottom 0.61: AVR_SPI_PRG.2 31.4,31.9 29.4,33.9 v24.1,33.9
  Bottom 1.56: 12.9,16.1 13,16.2 C22.+ 13.7,16.5 19,21.8 19,22.6 23.4,27 29.3,27 31.4,27 AVR_SPI_PRG.2
  Bottom 1.93: 1.4,39.8 1.4,41.7 4.9,45.2 6.4,45.2 8.2,47 8.2,47.82 $$U$2.8
  Bottom 2: 1.4,39.8 1.4,25.5 10.57,16.23 12.4,16.23 | 12.4,16.23 C22.+ | POWER.P$5 POWER.P$2 11.7,8.8 12.7,9.8 12.7,15.93 12.4,16.23 | $$U$2.1 8.14,67.54 9.5,68.9 35.1,68.9 52.1,68.9 53.86,67.14 U$5.1 U$5.2 | U$5.3 U$5.4
+5V-USB  (via drill 0.5, 0.6)
  Top 0.2: U1.31 50.85,24.45 52.4,22.9 v52.4,22.6
  Top 0.406: F1.2 49.63,15.9 v49,15.9 | v4.3,19.1 4.3,21.5 1.9,23.9 P-MOS.3
  Bottom 0.406: v4.3,19.1 4.3,18.9 3.2,17.8 3.2,3.5 5,1.7 44.5,1.7 45.55,2.75 45.55,13.35 48.1,15.9 v49,15.9 50.9,15.9 52.4,17.4 v52.4,22.6
ADC0  (via drill 0.3)
  Top 0.2: v16.3,50.6 18.8,48.1 24.9,48.1 ATMEGA1.37
  Bottom 0.2: v16.3,50.6 16.3,56.7 11.1,61.9 10.2,61.9 9.4,62.7 9.4,64.4 10.6,65.6 $$U$3.1
ADC1  (via drill 0.3)
  Top 0.2: v19.2,48.9 24.9,48.9 ATMEGA1.36
  Bottom 0.2: v19.2,48.9 19.2,54.6 $$U$3.2
ADC2  (via drill 0.3)
  Top 0.2: v12.1,55.7 18.1,49.7 24.9,49.7 ATMEGA1.35
  Bottom 0.2: v12.1,55.7 12.1,59.1 10.7,60.5 $$U$3.3
ADC3
  Top 0.2: ATMEGA1.34 24.9,50.5 18.2,50.5 10.7,58 $$U$3.4
ADC4  (via drill 0.3)
  Top 0.2: v18.1,51.5 19.1,52.5 27,52.5 ATMEGA1.33
  Bottom 0.2: v18.1,51.5 16.5,49.9 12.9,49.9 11.1,51.7 10.2,51.7 9.4,52.5 9.4,54.3 10.6,55.5 $$U$3.5
ADC5  (via drill 0.3)
  Top 0.2: ATMEGA1.32 27.8,53.6 27.4,54 v15.6,54
  Bottom 0.2: v15.6,54 11.7,54 10.7,53 $$U$3.6
ADC6
  Top 0.2: ATMEGA1.31 28.6,53.6 26.4,55.8 14.7,55.8 11.2,59.3 10.2,59.3 9.4,58.5 9.4,51.7 $$U$3.7
ADC7  (via drill 0.3)
  Top 0.2: ATMEGA1.30 29.4,51.6 29,51.2 v22.4,51.2
  Bottom 0.2: v22.4,51.2 19.1,47.9 10.7,47.9 $$U$3.8
AO1'
  Top 0.406: TB1.1 TB1.2
  Top 1: MOTOR-1.1 7.26,37.77 C10.1 7.68,37.78 9.59,39.7 TB1.1
AO2'
  Top 0.406: 10.3,36.8 10.4,36.9 | 10.4,36.9 10.59,37.09 TB1.5 | TB1.6 10.5,36.9 10.4,36.9
  Top 1: MOTOR-1.2 7.26,35.23 C10.2 8.25,35.65 9.4,36.8 10.3,36.8
AREF
  Top 0.254: ATMEGA1.29 30.25,52.63 30.25,53.5 26.25,57.5 C2.1
BO1'  (via drill 1.2)
  Top 0.406: TB1.11 10.66,32.9 10.6,32.9 | TB1.12 10.6,32.9 | 10.6,32.9 10.5,32.9
  Top 1: MOTOR-2.1 57.53,35.7 C9.2 | 10.5,32.9 10.4,32.8 v9,32.8
  Bottom 1: 17.63,35.23 15.2,32.8 v9,32.8
  Bottom 1.016: 17.63,35.23 MOTOR-2.1
BO2'  (via drill 1.2)
  Top 0.406: 11.6,35.5 11.5,35.6 | 11.5,35.6 11.3,35.8 TB1.7 | TB1.8 11.41,35.6 11.5,35.6
  Top 1: MOTOR-2.2 57.63,37.4 C9.1 | v13,35.8 12.7,35.5 11.6,35.5
  Bottom 1: v13,35.8 14.97,37.77 MOTOR-2.2
CMP
  Top 0.2: IC1.1 R9.2 R7.1
D+
  Top 0.2: R16.1 53.39,19.7 51.6,19.7 51,20.3 51,22.3 50.7,22.6 50.7,23.3 49.85,24.15 U1.29
D-
  Top 0.2: U1.30 50.35,24.25 51.4,23.2 51.4,21.31 R15.1
GATE_CMD  (via drill 0.6)
  Top 0.406: P-MOS.1 4.75,24.2 v5.1,24.2 | v7.8,23.3 7.85,23.35 IC1.4
  Bottom 0.406: v5.1,24.2 6,23.3 v7.8,23.3
GND  (via drill 0.5, 0.6, 0.8)
  Top 0.2: TB1.18 19.5,35.8 20,35.3 20,33.9 20.7,33.2 20.7,32.8 21.45,32.05 C13.2 | ST1S1.P$10 20.6,20.7 20.6,21.4 ST1S1.EPAD | C14.1 56.53,29.02 | 56.53,29.02 56.6,28.95 C15.1 | 56.53,29.02 56.22,29.02 55.6,28.4 53.5,28.4 53.1,28 53.1,27.1 52.75,26.75 U1.3 50.35,26.75 U1.EXP
  Top 0.254: PWR.C 31,54.35 ATMEGA1.28 | C1.2 30.2,56.96
  Top 0.406: IC1.2 5.6,24.9 5.3,25.2 5.3,26.9 4.5,27.7 4.5,30.7 | 4.5,30.7 v4.5,31.7 | R7.2 7.85,30.35 7.1,31.1 4.9,31.1 4.5,30.7 | 11.32,34.12 TB1.9 10.66,34.2 10.3,34.2 | 11.32,34.12 11.45,34 11.5,34 | TB1.10 11.23,34.12 11.32,34.12 | TB1.4 11.31,38.1 11.5,38.1 | TB1.3 11.25,38.1 12,38.1 | v31.7,47.6 32.02,47.28 ATMEGA1.18 39.38,47.28 40.51,48.41 C3.2 | v30.7,50.7 31,51 ATMEGA1.28 | v41.1,49.6 40.96,49.46 41.06,49.36 C3.2 | ST1S1.P$5 19.89,22.6 ST1S1.P$13 | 5.3,16.3 5.4,16.3 | 22.9,40.4 C7.2 22.95,40.95 22.1,41.8 22.1,44.7 23.88,46.48 ATMEGA1.39 27.32,46.48 v28.1,45.7 | ATMEGA1.6 31,37.3 29.2,37.3 28.6,36.7 28.6,36.3 27.66,35.36 C12.2 | 51.32,46.72 $$U$4.8 | v9.8,10.5 10.2,10.1 12.3,10.1 15.3,7.1 RESET.P$6 | 58.85,24.75 C17.1 | v20.6,28.3 R8.2 | C13.2 21.5,32 v22.7,32 24.7,32 | 24.7,32 35.2,32 36.04,32.84 C11.2 36,34 | v50.2,53.9 49.7,53.4 v49.7,53.3 | 46.7,44.4 v46.6,44.4 v44.8,46.6 44.8,48.2 44.59,48.41 C4.2 C3.2 | 60.8,41.2 60.8,25 61.4,24.4 61.4,23 61.3,22.9 59.7,22.9 59.6,23 59.6,24.8 59.2,24.8 58.4,24 58.3,24 58.3,25.5 59.1,26.3 59.8,26.3 59.8,27.4 59.7,27.4 59.6,27.3 59.6,26.4 59.7,26.4 59.7,27.3 59.6,27.4 v59.8,27.6 | v60.9,26.5 60.9,27.5 61,27.5 61.4,27.1 61.4,24.5 59.9,23 59.7,23 59.7,24.7 59.8,24.7 60.6,23.9 60.7,23.9 61.2,24.4 61.2,24.5 61.1,24.5 59.8,23.2 59.8,23.1 59.9,23.1 60.6,23.8 61.3,23.1 61.3,23 61.4,22.9 61.3,22.8 59.9,22.8 59.6,22.5 59.6,22.3 58.9,21.6 v53.5,21.6 | v44.6,13 v46.7,10.9 | v21.4,23.1 20.8,23.1 v19.2,24.7 | C12.2 27.6,35.1 24.7,32.2 24.7,32 | v6,15.5 6,17.5 7,17.5 7.85,18.35 R13.2 | C8.2 23.3,38.2 | C12.2
  Top 0.61: 11.5,34 13.7,34 14.4,34.7 14.4,38.8 13.95,39.25 | 27.19,62.82 CN1.1 26.69,64.7 L.C 23.7,64.7 23.7,66 19.55,68.9 17.5,68.9 | C17.1 60.2,26.25 | 60.2,26.25 60.2,27.9 59.15,28.95 C15.1 59.56,29.81 GROUND.1 60.4,32.84 60.4,41.1 | 51.32,44.28 $$U$4.8 | v60.7,24.6 60.2,25.1 60.2,26.25 | v46.9,7.2 44.08,7.2 $$$$U$1.P$2 | C23.- 39.3,19.97 R12.2 40.45,20.65 41.1,21.3 42.92,21.3 AVR_SPI_PRG1.6
  Top 0.813: ST1S1.P$8 19.7,18.8 19.8,18.7 | 11.5,38.1 12,38.1 12.8,38.1 13.95,39.25 C6.2 13.95,43.45 13.8,43.6 13.4,44 13.4,44.19 C5.2 | 7.85,30.35 7.4,30.8 7.4,33.8 8,34.4 9.4,34.4 9.6,34.2 10.3,34.2 | 23.3,38.2 26.2,35.3 C12.2 | 27.19,62.82 28,62.01 28,61.2 28.3,60.9 28.3,57.4 28.74,56.96 30.2,56.96 PWR.C
  Top 1.016: C18.2 24.9,22.8 ST1S1.P$4 23.7,22.6 ST1S1.P$14 | C22.- 13.37,18.4 19.5,18.4 19.8,18.7 ST1S1.P$17 | 5.1,45.8 5.3,45.6 12.4,45.6 13.8,44.2 13.8,43.6
  Top 1.27: ST1S1.P$16 21.8,17.9 22.65,17.05 C21.2 24.16,17.05 | ST1S1.P$13 ST1S1.P$12
  Top 1.93: 5.6,47.85 4.1,47.35 5.1,45.8
  Top 2: 5.6,47.85 $$U$1.8 $$U$1.7 $$U$1.6 $$U$1.5 $$U$1.4 $$U$1.3 $$U$1.2 $$U$1.1 5.6,67.8 6.7,68.9 17.5,68.9 | $$U$4.8 $$U$4.7 $$U$4.6 $$U$4.5 $$U$4.4 | $$U$4.3 $$U$4.2
  Bottom 0.406: v31.7,47.6 30.7,48.6 v30.7,50.7 | 41.2,49.6 v41.1,49.6 | v9.8,10.5 9.8,11.8 6.1,15.5 v6,15.5 | v28.1,45.7 28.9,46.5 28.9,62.49 CN1.1 | v22.7,32 20.6,29.9 v20.6,28.3 20.6,28.1 19.2,26.7 v19.2,24.7 | 51.37,52 53,52 53,51.4 51.3,49.7 50,49.7 49.9,49.8 49.9,53.9 50.3,54.3 52.3,54.3 52.8,53.8 52.8,53.7 51.6,52.5 51.6,52.1 52.8,52.1 52.8,52.2 50.8,54.2 50.3,54.2 50,53.9 50,49.8 51.3,49.8 52.9,51.4 52.9,51.9 51.6,51.9 51.6,50.2 51.3,49.9 50.1,49.9 50.1,53.9 50.3,54.1 50.8,54.1 50.9,54.2 52.3,54.2 52.7,53.8 52.7,53.7 52.1,53.1 52,53.1 51,54.1 50.2,53.3 50.2,50 51.3,50 51.5,50.2 51.5,50.3 50.3,50.3 50.3,53.3 50.2,53.4 v50.2,53.9 | v49.7,53.3 49.7,50.5 49.6,50.5 49.6,53.7 50.4,54.5 50.5,54.4 51.9,54.4 51.9,54.5 50.8,54.5 49.7,55.6 49.7,56.1 49.6,56.2 46.6,53.2 46.6,48 v44.8,46.6 | v50.4,44.4 v46.6,44.4 | v60.9,26.5 v59.8,27.6 | v53.5,21.6 53.5,17.7 v46.7,10.9 | v44.6,13 43,13 38.6,17.7 35.6,17.7 30.9,15.6 27.1,14.3 | v21.4,23.1 22.9,13.2 | 39.26,19.93 C23.- | AVR_SPI_PRG.6 39.26,29.81 | SW1.2 SW1.3
  Bottom 0.61: v46.9,7.2 50.4,10.7 57.8,10.7 58.7,11.6 58.7,22.9 60.4,24.6 v60.7,24.6
  Bottom 0.813: 22.9,13.2 27.1,14.3 | SW1.1 38.5,31.43 38.5,20.6 37.11,19.21 C23.-
  Bottom 1.27: 32.4,12.5 32.4,4.6 31.1,4.3 27.66,4.3 CN2.GND 27.6,4.3 22.9,4.3 20.8,4.9 20.5,4.9 20.7,5.1 RESET.P$3
  Bottom 1.56: C23.- 34.58,17.78 33.4,16.6 33.4,11.2 38.48,11.2 $$$$U$1.P$2
  Bottom 2: $$U$4.4 $$U$4.3 | $$U$4.2 $$U$4.1 50.87,66.11
  other vias: 29.3,30.6
  pour Top (isolate 1.27): 71,82.2 71,-7.8 -4,-7.8 -4,82.2
  pour Bottom (isolate 1.27): 71,87.2 71,-2.8 -4,-2.8 -4,87.2
IRC1  (via drill 0.3, 0.6)
  Top 0.2: 39.2,39.8 37.9,39.8 34.2,43.5 v34.2,45.7
  Top 0.254: ATMEGA1.23 35.42,53 v36.5,53
  Top 0.406: 39.2,39.8 39.16,39.8 SW1.6
  Bottom 0.254: v36.5,53 36.5,51.25 34.2,48.95 v34.2,45.7
IRC2  (via drill 0.3, 0.6)
  Top 0.2: v45.9,39.9 47.2,39.9 v48,39.1 | 48.2,43.7 v48.2,41.2
  Top 0.254: ATMEGA1.24 34.25,52.63 34.25,51.25 34.5,51 35.5,51 36.25,51.75 v38.5,51.75 | v44.5,51.75 48.2,48.05 48.2,43.7
  Bottom 0.2: 41.8,39.8 42.5,39.8 44,41.3 44.7,41.3 45.9,40.1 v45.9,39.9 | v48,39.1 48.6,39.7 48.6,40.8 v48.2,41.2
  Bottom 0.254: v38.5,51.75 v44.5,51.75
  Bottom 0.406: 41.8,39.8 41.7,39.8 SW1.5
IRC3  (via drill 0.3)
  Top 0.2: 44.3,39.7 44.3,37.8 v42.8,36.3 | v60.6,43.4 60.6,45.2 60.7,45.3 60.7,48.3 | 58.2,52.3 58.2,67.2 57,68.4 48.7,68.4
  Top 0.305: 48.7,68.4 44.3,64 44.3,57.7 40.85,54.25 34,54.25 33.4,53.65 ATMEGA1.25
  Top 0.406: 44.3,39.7 SW1.4 | 58.2,52.3 58.2,50.8 60.7,48.3
  Bottom 0.2: v42.8,36.3 52.1,36.3 52.3,36.1 56.4,36.1 57,36.7 59,36.7 60.6,38.3 v60.6,43.4
M1  (via drill 0.3 pad 0.61)
  Top 0.2: v26.6,45.7 26.58,45.68 ATMEGA1.40 | TB1.22 19.39,38.4 19.9,38.9 19.9,42.3 19.4,42.8 v19.4,45.7
  Bottom 0.2: v19.4,45.7 19.7,46 23.9,46 24.2,45.7 v26.6,45.7
M2  (via drill 0.3)
  Top 0.2: v20.4,43 20.4,38.8 19.4,37.8 18.3,37.8 TB1.21 | v23.3,44.7 24.8,44.7 24.9,44.8 ATMEGA1.41
  Bottom 0.2: v20.4,43 21.6,43 v23.3,44.7
M3  (via drill 0.3 pad 0.61)
  Top 0.2: v22.9,42.3 22.9,43.58 23.4,44.08 ATMEGA1.42 | v17.1,42.3 17.1,41.1 16.9,40.9 16.9,35.15 TB1.17
  Bottom 0.2: v17.1,42.3 v22.9,42.3
M4  (via drill 0.3 pad 0.61)
  Top 0.2: v19.4,34.2 19.6,34.19 19.3,34.49 TB1.16
  Top 0.254: v27.3,50.4 27.4,50.5 28.5,50.5 29.5,49.5 32.5,49.5 33,50 33,50.5 32.6,50.9 ATMEGA1.26
  Bottom 0.2: v27.3,50.4 27.3,47 26.8,46.5 26.7,46.6 19.3,46.6 10,37.3 10,36.6 7.3,33.9 7.3,32 7.8,31.5 17,31.5
  Bottom 0.254: v19.4,34.2 19.4,32.9 18,31.5 17,31.5
MISO  (via drill 0.3)
  Top 0.2: v27.8,42 ATMEGA1.2 | v40.4,34.2 v40.4,38.8
  Bottom 0.2: v27.8,42 37.8,42 38.4,41.4 40.4,41.4 | U$6.5 57.3,55.5 58,54.8 | 40.4,41.4 43.4,41.4 43.8,41.8 | v40.4,38.8 40.4,41.4 | v40.4,34.2 38.2,34.2 32.7,28.7 32.7,25.8 AVR_SPI_PRG.1
  Bottom 0.254: 43.8,41.8 50.1,41.8 53.2,44.9 56.6,44.9 58.2,46.5 58.2,54.6 58,54.8
MISO*
  Top 0.2: AVR_SPI_PRG1.1 43.6,27 45.7,27 46.2,27.5 46.2,28.8 46.65,29.25 U1.17
MOSI  (via drill 0.3)
  Top 0.2: v27,38.8 ATMEGA1.1 | v37.3,38.8 37.3,38.2 38.5,37 38.5,35.4 37.5,34.4 37.5,33.6 | 37.5,33.6 37.5,31.2 34,27.7 34,27.1 AVR_SPI_PRG.4 | v42.6,33.6 37.5,33.6
  Bottom 0.2: U$6.4 57.46,58.04 58.4,57.1 | v37.3,38.8 v27,38.8 | v42.6,33.6 46,33.6 48.3,31.3 52.8,31.3 55.6,34.1 59,34.1 61.2,36.3 61.2,44
  Bottom 0.254: 58.4,57.1 59.3,56.2 59.3,48.5 61.2,46.6 61.2,44
MOSI*  (via drill 0.3)
  Top 0.2: v47.3,30.5 47.4,30.6 47.6,30.6 47.85,30.35 U1.16
  Bottom 0.2: AVR_SPI_PRG1.4 47.3,28.22 v47.3,30.5
N$1
  Top 0.254: R17.1 31.9,57.05 PWR.A
N$2
  Top 1.27: CN2.PWR 27.6,13.18 27.6,13.3 30.1,15.8 30.5,15.8 30.5,16.83 D2.A
  Top 1.56: 30.5,15.8 36.6,15.8 37.1,15.3 C23.+ 38.6,13.75 $$$$U$1.P$1
N$3  (via drill 0.3)
  Top 0.2: v48.7,34.1 48.7,34.25 47.5,35.45 RX1.A | v48.6,31.9 48.45,31.75 R3.2
  Bottom 0.2: v48.7,34.1 48.7,32 v48.6,31.9
N$4
  Top 0.2: R4.2 50.75,31.75 51.1,32.1 51.1,34.35 TX1.A
N$5
  Top 0.2: U1.2 53.45,26.25 CRYSTAL2.1 55.4,25.5 57.6,25.5 58.7,26.6 C15.2
N$6  (via drill 0.6)
  Top 0.254: R2.2 v35.25,56 | v31.75,50.5 31.8,50.55 ATMEGA1.27
  Bottom 0.254: v35.25,56 35.25,53 32.75,50.5 v31.75,50.5
N$7
  Top 0.2: U1.1 52.85,25.75 53.6,25 55.7,25 56.35,24.35 CRYSTAL2.3 56.45,23.05 C17.2
N$8
  Top 0.2: C19.2 48.85,23.4 U1.27
N$9  (via drill 0.3)
  Top 0.2: v49.3,29 49.3,29.9 U1.13 | 39.5,22.1 39.3,22.3 R12.1 39.3,22.2
  Top 0.305: 39.5,22.1 v40.9,22.1 | C20.1 37.7,20.6 39.3,22.2
  Bottom 0.2: v49.3,29 49.3,27.7 48.8,27.2 48.8,26.4 46.1,23.7 46.1,22.7 45.4,22 41,22 v40.9,22.1
N$10
  Top 0.406: Z1.2 49.96,20.66 49.2,19.9 49.2,17.7 46.8,15.3 46.8,13.7 49.25,11.25 X1.M3
  Top 0.61: X1.M3 49.16,6.9 | X1.M4 59.2,9.86 59.2,16.7 58.7,17.2 L2.2 58,20 57.4,20.6 56.26,20.6 Z2.2
  Top 0.813: X1.M3 X1.M2 X1.M1 X1.M4
N$11
  Top 0.305: CN1.3 32.15,64.08 D3.C
N$17
  Top 0.254: L.A 23.89,62.86 R1.1
N$20
  Top 0.406: X1.1 52.1,12.85 F1.1
N$21
  Top 0.406: X1.2 52.9,18.11 R15.2 52.2,18.66 Z1.1
N$23
  Top 0.406: X1.3 53.7,18.31 R16.2 54.2,18.66 Z2.1
N$37
  Top 1.016: 17.4,20.1 17.43,20.06
  Top 1.27: 17.43,20.06 ST1S1.P$7
  Top 2: L1.P$1 15.1,24.38 15.1,21.5 16.5,20.1 17.4,20.1
N$38  (via drill 0.8)
  Top 0.61: ST1S1.P$3 25.47,21.34 v25.8,21.3 | v25.7,24.5 23.45,26.75 23.45,26.9
  Top 0.813: R8.1 23.45,26.9 R10.2 C16.2
  Bottom 0.61: v25.8,21.3 25.8,24.4 v25.7,24.5
N$40
  Top 0.406: ATMEGA1.8 32.6,38.13 33.83,36.9 CRYSTAL1.3 36.04,36.07 C11.1
N$41
  Top 0.406: ATMEGA1.7 31.8,35.44 CRYSTAL1.1 27.66,33.77 C12.1 27.68,33.77
PC2  (via drill 0.3 pad 0.61)
  Top 0.2: v25.4,56.5 25.42,56.52
  Top 0.254: R1.2 25.22,56.5 v25.4,56.5 | v28,49 28.75,48.25 30.75,48.25 31,48.5 34.25,48.5 35.43,49.68 ATMEGA1.21
  Bottom 0.2: v25.4,56.5 28,53.9 v28,49
PD6  (via drill 0.3)
  Top 0.2: v41.2,45.5 40.6,44.9 37.1,44.9 ATMEGA1.15
  Bottom 0.2: 50.9,49.2 55.2,49.2 56.4,50.4 U$6.7
  Bottom 0.254: v41.2,45.5 41.5,45.8 46.8,45.8 50.2,49.2 50.9,49.2
PD7  (via drill 0.3)
  Top 0.2: v40.2,45.6 37.1,45.6 ATMEGA1.16
  Bottom 0.2: v40.2,45.6 41,44.8 43,44.8 | U$6.8 55.96,47.44
  Bottom 0.254: 43,44.8 43.5,45.3 47.9,45.3 49.2,46.6 55.12,46.6 55.96,47.44
PWM1  (via drill 0.3)
  Top 0.2: TB1.23 18.26,39.1 19.3,39.1 19.4,39.2 19.4,41.1 18.8,41.7 v18.8,44 | v34.8,44 35.52,43.28 ATMEGA1.13
  Bottom 0.2: v18.8,44 20.2,45.4 23.6,45.4 25.2,43.8 32.2,43.8 32.4,44 v34.8,44
PWM2  (via drill 0.3)
  Top 0.2: v47.4,41.2 47.2,41.2 45.3,43.1 44.6,43.1 43.9,42.4 43,42.4 41.32,44.08 ATMEGA1.14 | TB1.15 18.3,33.8 19,33.8 20.8,32 20.8,31.5 21,31.3 25.7,31.3 30.2,26.8 30.2,24 33,21.2 34.3,21.2 34.5,21.4 36.9,21.4 41.1,25.6 41.1,28.8 41.9,29.6 44,29.6 45.4,31 45.4,37.1 v47.1,38.8
  Bottom 0.2: v47.1,38.8 47.1,39.1 47,39.2 47,40.8 v47.4,41.2
RESET  (via drill 0.3)
  Top 0.2: ATMEGA1.4 29.4,38.2 v27.9,36.7 | v36.9,36.7 36.9,31.8 32.7,27.6 32.7,26.5 33.4,25.8 35.1,25.8 36.4,24.5 AVR_SPI_PRG.5
  Top 0.305: R18.1 18.65,12.25 | 18.65,12.25 18.65,10.85 | 18.65,10.85 16.6,8.8 RESET.P$5 | 18.65,10.85 RESET.P$2 | 18.65,12.25 19.4,13 22.8,13 v25,15.2 25.3,15.5 27.9,15.5 29.1,16.7 29.1,17.5 32.2,20.6 C20.2
  Bottom 0.2: AVR_SPI_PRG.5 36.9,24.07 36.9,22.3 33.2,18.6 27.3,18.6 25,16.3 v25,15.2 | v36.9,36.7 v27.9,36.7
RESET2
  Top 0.2: AVR_SPI_PRG1.5 43.58,24.5 45.8,24.5 46.3,25 | 46.3,25 46.3,25.5 46.55,25.75 U1.24 | 46.3,25 46.3,22.25 R14.1 47.2,20.55 D1.A
RX0  (via drill 0.3, 0.6)
  Top 0.2: ATMEGA1.9 33.4,42.2 32.4,43.2 32.4,45.4 v32.2,45.6 | v37.9,36.7 36.3,38.3 36.2,38.3 | R5.1 53,36.3 v52.6,36.7
  Top 0.254: v36.7,39.4 36.2,38.9 36.2,38.3 35.9,38 34.1,38 33.4,38.7 ATMEGA1.9
  Top 0.305: v37.8,61 37.7,61.1 D3.A
  Bottom 0.2: v32.2,45.6 29.9,47.9 | v52.6,36.7 43.3,36.7 43.1,36.9 38.1,36.9 v37.9,36.7
  Bottom 0.254: 29.9,47.9 29.9,59.3 31.6,61 v37.8,61
RXLED1
  Top 0.2: U1.10 50.85,30.55 52,31.7 52,37.2 50.5,38.7 48.5,38.7 47.5,37.7 RX1.C
RXO'
  Top 0.305: U1.9 51.35,30.05 53,31.7 R5.2
SCK  (via drill 0.3)
  Top 0.2: v28.6,42.7 ATMEGA1.3 | v33.9,21.8 36.8,21.8 40.1,25.1 40.1,28.8 41.3,30 42.2,30 43.2,31 43.2,35.8 v46.3,38.9 | v45.1,42.5 v46.5,41.1
  Bottom 0.2: v28.6,42.7 45.1,42.7 v45.1,42.5 | 57.6,47.3 57.6,51.76 U$6.6 | v33.9,21.8 33.9,24.4 AVR_SPI_PRG.3 | v46.3,38.9 46.3,39.4 46.5,39.6 v46.5,41.1
  Bottom 0.254: 45.1,42.7 45.3,42.5 49.6,42.5 52.6,45.5 56.4,45.5 57.6,46.7 57.6,47.3
SCK*  (via drill 0.3)
  Top 0.2: v48.4,29 48.35,29.05 U1.15
  Bottom 0.2: AVR_SPI_PRG1.3 43.56,24.5 45.8,24.5 48.4,27.1 v48.4,29
SCL
  Top 0.2: 37.1,48.1 ATMEGA1.19 | U$6.1 54.66,67.4
  Top 0.254: 46.3,56.2 47.1,57 47.1,64.3 50.2,67.4 54.66,67.4
  Top 0.305: ATMEGA1.19 39.28,48.08 39.9,48.7 39.9,49.8 46.3,56.2
SDA
  Top 0.2: 37.1,48.9 ATMEGA1.20 | U$6.2 57.8,64.52 57.8,67 56.8,68 49.66,68 45.8,64.14
  Top 0.305: 37.1,48.9 39.3,48.9 39.4,49 39.4,51.2 45.8,57.6 45.8,64.14
STBY  (via drill 0.3 pad 0.61)
  Top 0.2: TB1.19 19.4,36.45 20.14,35.7 20.4,35.7 20.6,35.5 v20.6,34.2
  Top 0.254: v26.6,49.7 26.65,49.75 28.5,49.75 29.25,49 34,49 35.48,50.48 ATMEGA1.22
  Bottom 0.2: v26.6,49.7 21.5,49.7 17.4,45.6 | 9.5,37.2 6.6,34.3 6.6,31.9 7.6,30.9 16.9,30.9 17,31 18.4,31
  Bottom 0.254: v20.6,34.2 20.6,32.9 18.7,31 18.4,31 | 17.4,45.6 9.5,37.7 9.5,37.2
TX0  (via drill 0.3)
  Top 0.2: ATMEGA1.10 34.2,42.1 33.1,43.2 v33.1,45.4 | v50.7,41 48.9,41 48.5,40.6 46.9,40.6 46.8,40.5 45.5,40.5 44.7,41.3 v37.3,41.3
  Top 0.254: R6.1 55,33.7 53.6,35.1 53.6,38.1 v50.7,41 | ATMEGA1.10 34.2,39.1 34.8,38.5 35.3,38.5 35.7,38.9 35.7,40.1 v36.2,40.6
  Bottom 0.2: v33.1,45.4 32.6,44.9 31.5,44.9 29.5,46.9 29.5,63.97 CN1.2 | v37.3,41.3 36.9,41.3 v36.2,40.6
TX0'
  Top 0.254: U1.8 52.45,29.25 54,30.8 R6.2
TXLED1
  Top 0.2: U1.11 50.35,30.85 51.6,32.1 51.6,35.95 50.2,37.35 TX1.C
UGND  (via drill 0.3, 0.6)
  Top 0.2: C19.1 49.35,23 U1.28 49.35,25.85 v49.2,26 | v56.4,31.9 56.5,32 GROUND.2
  Top 0.254: v49.2,21.4 49.75,21.95 C19.1
  Top 0.406: X1.5 55.3,13.3 57,15 L2.1 57.3,15 v56.1,16.2
  Bottom 0.2: v49.2,26 49.2,27.1 54,31.9 v56.4,31.9
  Bottom 0.254: 53.7,23.7 50.85,23.7 49.2,22.05 v49.2,21.4
  Bottom 0.406: v56.1,16.2 54.3,18 54.3,23.1 53.7,23.7
VIN  (via drill 0.6)
  Top 0.2: 15.7,44.7 C5.1 | 15.7,43 C6.1 | 7.9,27.9 R9.1 | 18.2,32.5 TB1.13 | D2.C 30.38,21.05 | C21.1 27.58,19.12 | ST1S1.P$1 24.75,18.75 | C18.1 28.83,22.8
  Top 0.406: TB1.14 TB1.13 | TB1.24 18.2,43.3 16.76,44.74 C5.1 | v17.5,22.5 18.6,21.4 18.8,21.4 ST1S1.P$6 | 19.02,31.73 v17.5,30.2
  Top 0.813: VIN.P$1 28.55,26.85 28.65,26.85
  Top 1.56: C18.1 28.75,26.75 28.65,26.85 25.3,30.2 20.55,30.2 19.02,31.73 TB1.13 16.14,32.55 15.65,32.05 | 28.83,22.8 D2.C | 30.38,21.05 28.08,18.75 C21.1 24.75,18.75 | ST1S1.P$2 ST1S1.P$1 | 7.9,27.9 8.8,27.9 12.2,31.3 14.9,31.3 15.65,32.05 | 15.65,32.05 C6.1 | 15.7,43 15.65,43.05 C5.1
  Bottom 0.406: v17.5,30.2 v17.5,22.5

### Text on the board
tPlace: GND | TX | RX | VCC | EBot | + | + | + | -
bPlace: D0 SCL (PC0) / D1 SDA (PC1) / D2 SS (PB4/PWM) / D3 MOSI(PB5) / D4 MISO(PB6/PWM) / D5 SCK(PB7/PWM) / D6 PD6(PWM) / D7 PD7(PWM) | A0 ADC0(PA0) / A1 ADC1(PA1) / A2 ADC2(PA2) / A3 ADC3(PA3) / A4 ADC4(PA4) / A5 ADC5(PA5) / A6 ADC6(PA6) / A7 ADC7(PA7) | www.cbits.cc
tNames: GND | +5V | GND | +5V | 8 | A0 / A1 / A2 / A3 / A4 / A5 / A6 / A7 | 0 / 1 / 2 / 3 / 4 / 5 / 6 / 7 | +5V | VIN | 5V-OUT